# EAGLE schematic ECE411_G16_V12 (EAGLE 9.2.1)
Version 6: Added bypass capacitors to uC +Vcc, added test points for I2C.
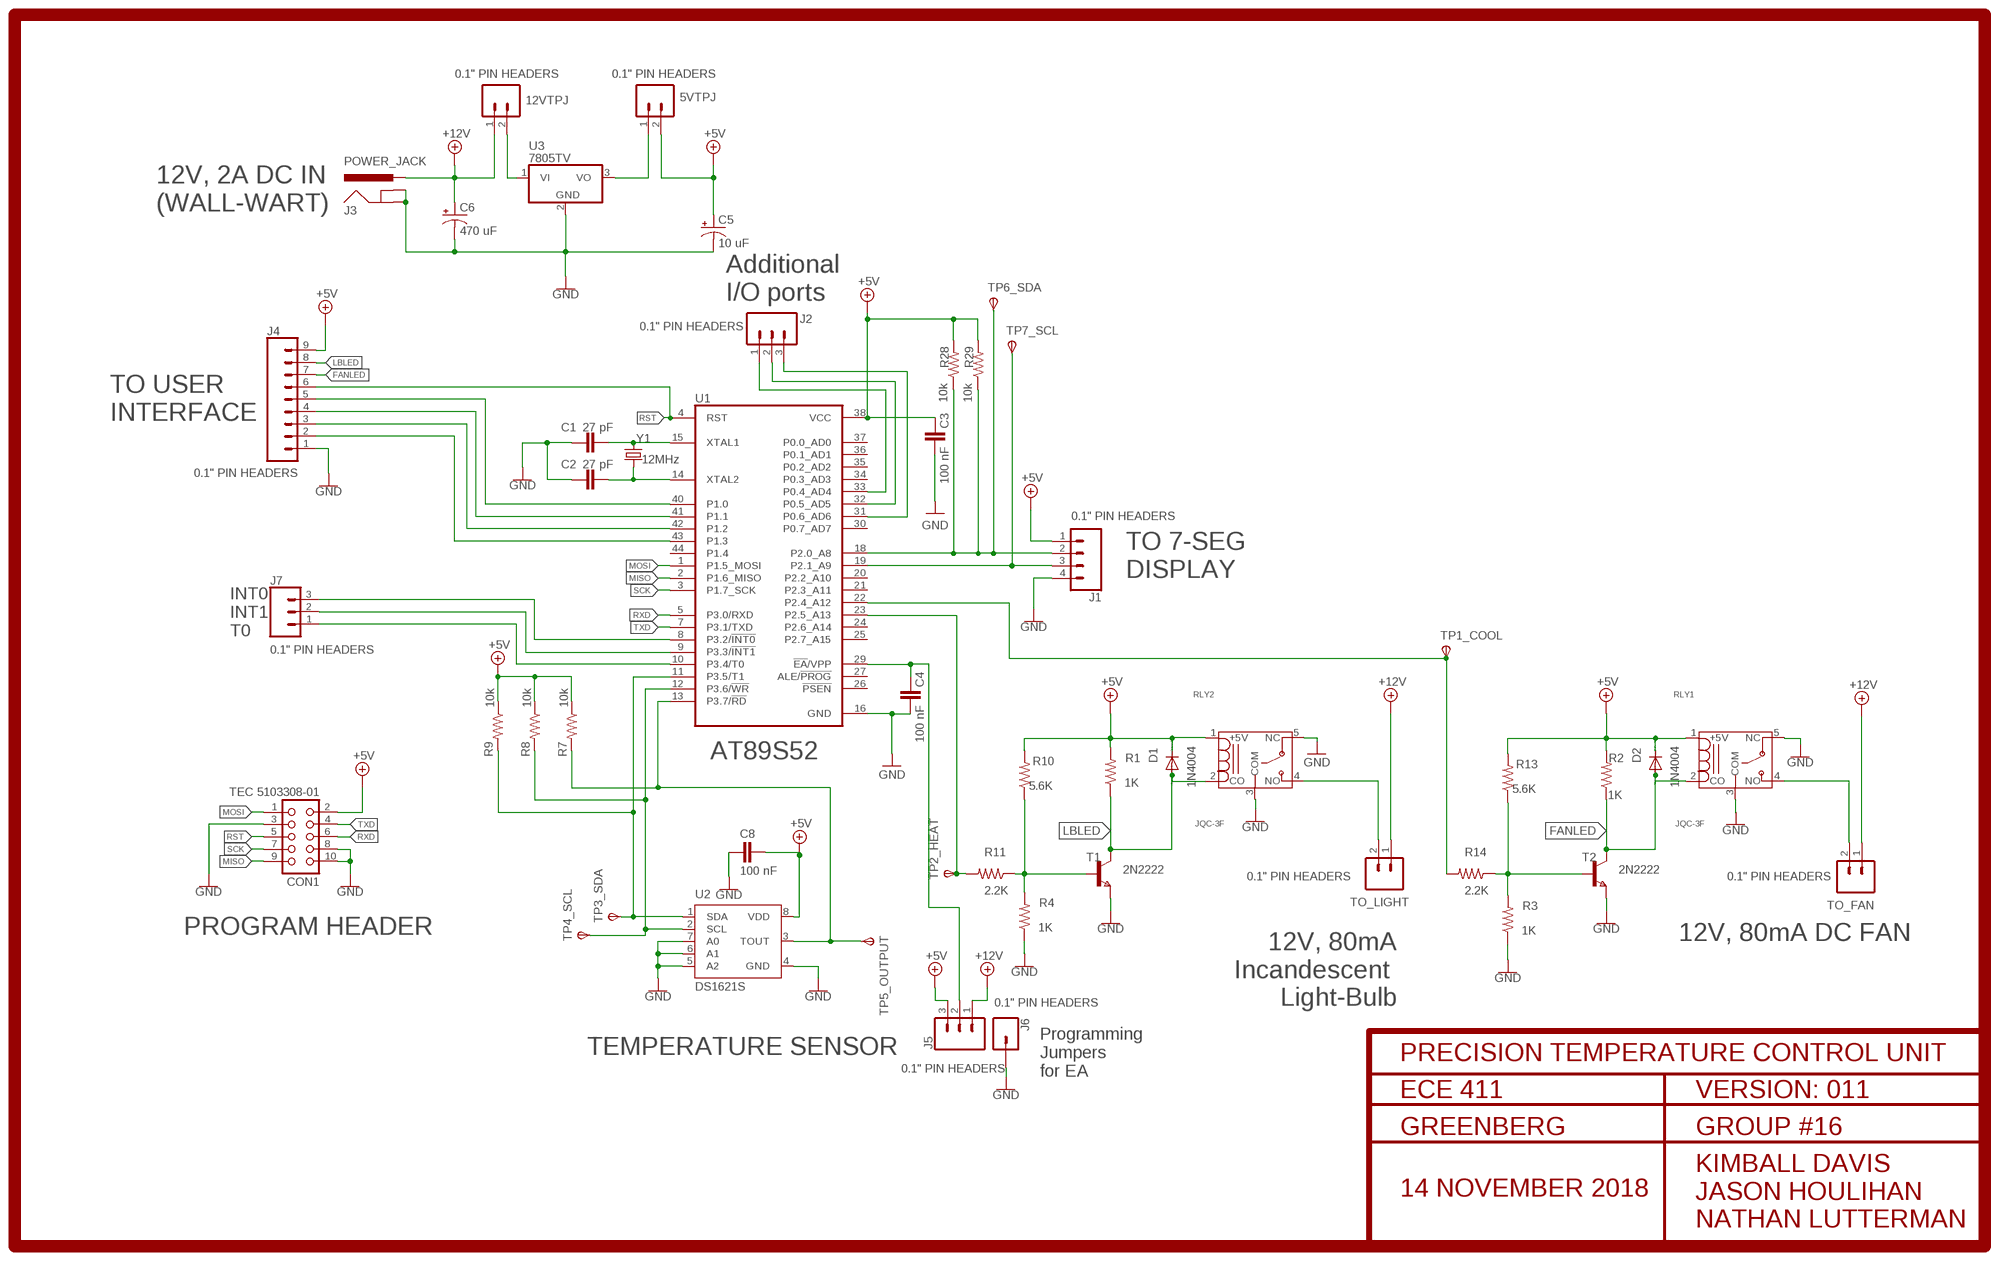
[diagram p0: schematic, sheet 1]

## Parts
5VTPJ  0.1" PIN HEADERS  CONN_02  [1X02]
12VTPJ  0.1" PIN HEADERS  CONN_02  [1X02]
C1  27 pF  CAPACITOR_0603_M  [RESC0603_M]
C2  27 pF  CAPACITOR_0603_M  [RESC0603_M]
C3  100 nF  CAPACITOR_0603_M  [RESC0603_M]
C4  100 nF  CAPACITOR_0603_M  [RESC0603_M]
C5  10 uF  CPOL-USTT2D6  [TT2D6]
C6  470 uF  CPOL-USTT5D11  [TT5D11]
C8  100 nF  CAPACITOR_0603_M  [RESC0603_M]
CON1  TEC 5103308-01  CON10  [CON10]
D1  1N4004  [DO41-10]
D2  1N4004  [DO41-10]
J1  0.1" PIN HEADERS  CONN_04  [1X04]
J2  0.1" PIN HEADERS  CONN_03  [1X03]
J3  POWER_JACK  [POWER_JACK_PTH]
J4  0.1" PIN HEADERS  CONN_09  [1X09]
J5  0.1" PIN HEADERS  CONN_03  [1X03]
J6  0.1" PIN HEADERS  CONN_01  [1X01]
J7  0.1" PIN HEADERS  CONN_03  [1X03]
R1  1K  R-US_R0603  [R0603]
R2  1K  R-US_R0603  [R0603]
R3  1K  R-US_R0603  [R0603]
R4  1K  R-US_R0603  [R0603]
R7  10k  R-US_R0603  [R0603]
R8  10k  R-US_R0603  [R0603]
R9  10k  R-US_R0603  [R0603]
R10  5.6K  R-US_R0603  [R0603]
R11  2.2K  R-US_R0603  [R0603]
R13  5.6K  R-US_R0603  [R0603]
R14  2.2K  R-US_R0603  [R0603]
R28  10k  R-US_R0603  [R0603]
R29  10k  R-US_R0603  [R0603]
RLY1  JQC-3F  [T073]
RLY2  JQC-3F  [T073]
T1  2N2222  NPNSOT23  [SOT-23]
T2  2N2222  NPNSOT23  [SOT-23]
TO_FAN  0.1" PIN HEADERS  CONN_02  [1X02]
TO_LIGHT  0.1" PIN HEADERS  CONN_02  [1X02]
TP1_COOL  TPSTP20SQ  [TP20SQ]
TP2_HEAT  TPSTP20SQ  [TP20SQ]
TP3_SDA  TPSTP20SQ  [TP20SQ]
TP4_SCL  TPSTP20SQ  [TP20SQ]
TP5_OUTPUT  TPSTP20SQ  [TP20SQ]
TP6_SDA  TPSTP20SQ  [TP20SQ]
TP7_SCL  TPSTP20SQ  [TP20SQ]
U1  AT89S52  AT89S51-24P  [TQFP44]
U2  DS1621S  [SO08]
U3  7805TV  [TO220V]
Y1  12MHz  CRYSTAL-12MHZ"  [CRYSTAL-SMD-5X3.2-4PAD]

## Nets
+5V: 5VTPJ.2 C3.2 C5.+ C8.2 CON1.2 D1.C D2.C J1.1 J4.9 J5.3 R1.2 R2.2 R7.1 R8.1 R9.1 R10.2 R13.2 R28.2 R29.2 RLY1.1(+5V) RLY2.1(+5V) U1.38(VCC) U2.8(VDD)
+12V: 12VTPJ.1 C6.+ J3.PWR J5.1 TO_FAN.1 TO_LIGHT.1
FANLED: D2.A J4.7 R2.1 RLY1.2(CO) T2.1(C)
GND: C1.1 C2.1 C3.1 C4.1 C5.- C6.- C8.1 CON1.3 CON1.8 CON1.10 J1.4 J3.GND J3.GNDBREAK J4.1 J6.1 R3.1 R4.1 RLY1.3(COM) RLY1.5(NC) RLY2.3(COM) RLY2.5(NC) T1.2(E) T2.2(E) U1.16(GND) U2.4(GND) U2.5(A2) U2.6(A1) U2.7(A0) U3.2(GND)
LBLED: D1.A J4.8 R1.1 RLY2.2(CO) T1.1(C)
MISO: CON1.9 U1.2(P1.6_MISO)
MOSI: CON1.1 U1.1(P1.5_MOSI)
N$1: C1.2 U1.15(XTAL1) Y1.1
N$2: C2.2 U1.14(XTAL2) Y1.3
N$3: J1.2 R28.1 R29.1 TP6_SDA.TP(PP) U1.18(P2.0_A8)
N$4: J1.3 TP7_SCL.TP(PP) U1.19(P2.1_A9)
N$5: 12VTPJ.2 U3.1(VI)
N$6: 5VTPJ.1 U3.3(VO)
N$7: RLY2.4(NO) TO_LIGHT.2
N$8: C4.2 J5.2 U1.29(!EA!/VPP)
N$9: R7.2 TP5_OUTPUT.TP(PP) U1.13(P3.7/!RD) U2.3(TOUT)
N$10: R8.2 TP4_SCL.TP(PP) U1.12(P3.6/!WR) U2.2(SCL)
N$11: R9.2 TP3_SDA.TP(PP) U1.11(P3.5/T1) U2.1(SDA)
N$12: R11.2 TP2_HEAT.TP(PP) U1.23(P2.5_A13)
N$13: R4.2 R10.1 R11.1 T1.3(B)
N$14: J2.1 U1.33(P0.4_AD4)
N$15: J2.2 U1.32(P0.5_AD5)
N$16: R14.2 TP1_COOL.TP(PP) U1.22(P2.4_A12)
N$17: R3.2 R13.1 R14.1 T2.3(B)
N$18: J2.3 U1.31(P0.6_AD6)
N$20: RLY1.4(NO) TO_FAN.2
N$21: J7.3 U1.8(P3.2/!INT0)
N$22: J7.2 U1.9(P3.3/!INT1)
N$23: J7.1 U1.10(P3.4/T0)
N$34: J4.5 U1.40(P1.0)
N$35: J4.4 U1.41(P1.1)
N$36: J4.3 U1.42(P1.2)
N$37: J4.2 U1.43(P1.3)
RST: CON1.5 J4.6 U1.4(RST)
RXD: CON1.6 U1.5(P3.0/RXD)
SCK: CON1.7 U1.3(P1.7_SCK)
TXD: CON1.4 U1.7(P3.1/TXD)
Unconnected: U1.20(P2.2_A10) U1.21(P2.3_A11) U1.24(P2.6_A14) U1.25(P2.7_A15) U1.26(!PSEN) U1.27(ALE/!PROG) U1.30(P0.7_AD7) U1.34(P0.3_AD3) U1.35(P0.2_AD2) U1.36(P0.1_AD1) U1.37(P0.0_AD0) U1.44(P1.4)

## Notes on the sheet
- 12V, 2A DC IN
  (WALL-WART)
- Additional
  I/O ports
- TO USER
  INTERFACE
- TO 7-SEG 
  DISPLAY
- INT0
  INT1
  T0
- AT89S52
- PROGRAM HEADER | 12V, 80mA DC FAN
- 12V, 80mA
  Incandescent 
  Light-Bulb
- TEMPERATURE SENSOR
- Programming
  Jumpers
  for EA

## Power pins joined to a net without a drawn wire
GND: U1.17(GND)

## Library data of the parts
5VTPJ 12VTPJ TO_FAN TO_LIGHT = SparkFun-Connectors:CONN_02: Multi connection point. Often used as Generic Header-pin footprint for 0.1 inch spaced/style header connections On any of the 0.1 inch spaced packages, you can populate with these: Break Away Headers - Straight <https://www.sparkfun.com/products/116> (PRT-00116) Break Away Male Headers - Right Angle <https://www.sparkfun.com/products/553> (PRT-00553) Female Headers <https://www.sparkfun.com/products/115> (PRT-00115) Break Away Headers - Machine Pin <https://www.sparkfun.com/products/117> (PRT-00117) Break Away Female Headers - Swiss Machine Pin <https://www.sparkfun.com/products/743> (PRT-00743) For SCREWTERMINALS and SPRING TERMINALS visit here: Screw Terimnals on SparkFun.com <https://www.sparkfun.com/search/results?term=Screw+Terminals> (5mm/3.5mm/2.54mm spacing) This device is also useful as a general connection point to wire up your design to another part of your project. Our various solder wires solder well into these plated through hole pads. Hook-Up Wire - Assortment (Stranded, 22 AWG) <https://www.sparkfun.com/products/11375> (PRT-11375) Hook-Up Wire - Assortment (Solid Core, 22 AWG) <https://www.sparkfun.com/products/11367> (PRT-11367) View the entire wire category on our website here <https://www.sparkfun.com/categories/141> Special notes: Molex polarized connector foot print use with: PRT-08233 with associated crimp pins and housings. 2.54_SCREWTERM for use with PRT-10571. 3.5mm Screw Terminal footprints for PRT-08084 5mm Screw Terminal footprints for use with PRT-08432
C1-C4 C8 = Nordic_nRF:CAPACITOR: Generic chip capacitor
C5 C6 = rcl:CPOL-US: POLARIZED CAPACITOR, American symbol; SPICEPREFIX: C
CON1 = con-harting:CON10: CONNECTOR; OC_FARNELL: unknown; OC_NEWARK: unknown
D1 D2 = diode:1N4004: DIODE general purpose rectifier, 1 A
J1 = SparkFun-Connectors:CONN_04: Multi connection point. Often used as Generic Header-pin footprint for 0.1 inch spaced/style header connections On any of the 0.1 inch spaced packages, you can populate with these: Break Away Headers - Straight <https://www.sparkfun.com/products/116> (PRT-00116) Break Away Male Headers - Right Angle <https://www.sparkfun.com/products/553> (PRT-00553) Female Headers <https://www.sparkfun.com/products/115> (PRT-00115) Break Away Headers - Machine Pin <https://www.sparkfun.com/products/117> (PRT-00117) Break Away Female Headers - Swiss Machine Pin <https://www.sparkfun.com/products/743> (PRT-00743) For SCREWTERMINALS and SPRING TERMINALS visit here: Screw Terimnals on SparkFun.com <https://www.sparkfun.com/search/results?term=Screw+Terminals> (5mm/3.5mm/2.54mm spacing) This device is also useful as a general connection point to wire up your design to another part of your project. Our various solder wires solder well into these plated through hole pads. Hook-Up Wire - Assortment (Stranded, 22 AWG) <https://www.sparkfun.com/products/11375> (PRT-11375) Hook-Up Wire - Assortment (Solid Core, 22 AWG) <https://www.sparkfun.com/products/11367> (PRT-11367) View the entire wire category on our website here <https://www.sparkfun.com/categories/141> Special notes: Molex polarized connector foot print use with SKU : PRT-08231 with associated crimp pins and housings. 1MM SMD Version SKU: PRT-10208; PROD_ID: CONN-09696
J2 J5 J7 = SparkFun-Connectors:CONN_03: Multi connection point. Often used as Generic Header-pin footprint for 0.1 inch spaced/style header connections On any of the 0.1 inch spaced packages, you can populate with these: Break Away Headers - Straight <https://www.sparkfun.com/products/116> (PRT-00116) Break Away Male Headers - Right Angle <https://www.sparkfun.com/products/553> (PRT-00553) Female Headers <https://www.sparkfun.com/products/115> (PRT-00115) Break Away Headers - Machine Pin <https://www.sparkfun.com/products/117> (PRT-00117) Break Away Female Headers - Swiss Machine Pin <https://www.sparkfun.com/products/743> (PRT-00743) Stackable Header - 3 Pin (Female, 0.1") <https://www.sparkfun.com/products/13875> (PRT-13875) For SCREWTERMINALS and SPRING TERMINALS visit here: Screw Terimnals on SparkFun.com <https://www.sparkfun.com/search/results?term=Screw+Terminals> (5mm/3.5mm/2.54mm spacing) This device is also useful as a general connection point to wire up your design to another part of your project. Our various solder wires solder well into these plated through hole pads. Hook-Up Wire - Assortment (Stranded, 22 AWG) <https://www.sparkfun.com/products/11375> (PRT-11375) Hook-Up Wire - Assortment (Solid Core, 22 AWG) <https://www.sparkfun.com/products/11367> (PRT-11367) View the entire wire category on our website here <https://www.sparkfun.com/categories/141> Special notes: Molex polarized connector foot print use with SKU : PRT-08232 with associated crimp pins and housings.
J3 = SparkFun-Connectors:POWER_JACK: Power Jack Connector This is the standard 5.5mm barrel jack for power. The PTH is the most common, proven, reliable, footprint. The Slot footprint only works if the mill layer is transmitted to the PCB fab house so be warned. Here are the connectors we sell at SparkFun: DC Barrel Power Jack/Connector <https://www.sparkfun.com/products/119> (PRT-00119) DC Barrel Power Jack/Connector (SMD) <https://www.sparkfun.com/products/12748> (PRT-12748) DC Barrel Jack Adapter - Breadboard Compatible <https://www.sparkfun.com/products/10811> (PRT-10811) It is used on this SparkFun product (and many, many others): SparkFun RedBoard - Programmed with Arduino <https://www.sparkfun.com/products/12757> (DEV-12757) Also, if you need a mating power supply or connector, please check these out: Wall Adapter Power Supply - 9VDC 650mA <https://www.sparkfun.com/products/298> (TOL-00298) DC Barrel Jack Adapter - Male <https://www.sparkfun.com/products/10287> (PRT-10287); PROD_ID: CONN-08197
J4 = SparkFun-Connectors:CONN_09: Multi connection point. Often used as Generic Header-pin footprint for 0.1 inch spaced/style header connections On any of the 0.1 inch spaced packages, you can populate with these: Break Away Headers - Straight <https://www.sparkfun.com/products/116> (PRT-00116) Break Away Male Headers - Right Angle <https://www.sparkfun.com/products/553> (PRT-00553) Female Headers <https://www.sparkfun.com/products/115> (PRT-00115) Break Away Headers - Machine Pin <https://www.sparkfun.com/products/117> (PRT-00117) Break Away Female Headers - Swiss Machine Pin <https://www.sparkfun.com/products/743> (PRT-00743) For SCREWTERMINALS and SPRING TERMINALS visit here: Screw Terimnals on SparkFun.com <https://www.sparkfun.com/search/results?term=Screw+Terminals> (5mm/3.5mm/2.54mm spacing) This device is also useful as a general connection point to wire up your design to another part of your project. Our various solder wires solder well into these plated through hole pads. Hook-Up Wire - Assortment (Stranded, 22 AWG) <https://www.sparkfun.com/products/11375> (PRT-11375) Hook-Up Wire - Assortment (Solid Core, 22 AWG) <https://www.sparkfun.com/products/11367> (PRT-11367) View the entire wire category on our website here <https://www.sparkfun.com/categories/141> Special notes: Molex polarized connector foot print use with SKU : PRT-08231 with associated crimp pins and housings. 1MM SMD Version SKU: PRT-10208 NOTES ON THE VARIANTS LOCK and LOCK_LONGPADS... This footprint was designed to help hold the alignment of a through-hole component (i.e. 6-pin header) while soldering it into place. You may notice that each hole has been shifted either up or down by 0.005 of an inch from it's more standard position (which is a perfectly straight line). This slight alteration caused the pins (the squares in the middle) to touch the edges of the holes. Because they are alternating, it causes a "brace" to hold the component in place. 0.005 has proven to be the perfect amount of "off-center" position when using our standard breakaway headers. Although looks a little odd when you look at the bare footprint, once you have a header in there, the alteration is very hard to notice. Also,if you push a header all the way into place, it is covered up entirely on the bottom side.
J6 = SparkFun-Connectors:CONN_01: Single connection point. Often used as Generic Header-pin footprint for 0.1 inch spaced/style header connections On any of the 0.1 inch spaced packages, you can populate with these: Break Away Headers - Straight <https://www.sparkfun.com/products/116> (PRT-00116) Break Away Male Headers - Right Angle <https://www.sparkfun.com/products/553> (PRT-00553) Female Headers <https://www.sparkfun.com/products/115> (PRT-00115) Break Away Headers - Machine Pin <https://www.sparkfun.com/products/117> (PRT-00117) Break Away Female Headers - Swiss Machine Pin <https://www.sparkfun.com/products/743> (PRT-00743) This device is also useful as a general connection point to wire up your design to another part of your project. Our various solder wires solder well into these plated through hole pads. Hook-Up Wire - Assortment (Stranded, 22 AWG) <https://www.sparkfun.com/products/11375> (PRT-11375) Hook-Up Wire - Assortment (Solid Core, 22 AWG) <https://www.sparkfun.com/products/11367> (PRT-11367) View the entire wire category on our website here <https://www.sparkfun.com/categories/141> Special notes: SMTSO-256-ET is a "flush mount" nut for a 4-40 screw. We mostly use this on specialty testbeds; it is a nice way to connect hardware to your PCB at an adjustable hieght. Also note, the SNAP packages are for using a snappable style connector. We sell a baggie of snaps and they are also used on two LilyPad designs: Snap Assortment - 30 pack (male and female) <https://www.sparkfun.com/products/11347> (DEV-11347) LilyPad Arduino SimpleSnap <https://www.sparkfun.com/products/10941> (DEV-10941) LilyPad SimpleSnap Protoboard <https://www.sparkfun.com/products/10940> (DEV-10940)
R1-R4 R7-R11 R13 R14 R28 R29 = audio amplifier example:R-US_: RESISTOR, American symbol
RLY1 RLY2 = JQC-3F:JQC-3F
T1 T2 = zetex:NPNSOT23: NPN TRANSISTOR; MPN: DSS20201L-7; OC_FARNELL: 1710688; OC_NEWARK: 25R4555
TP1_COOL TP2_HEAT TP3_SDA TP4_SCL TP5_OUTPUT TP6_SDA TP7_SCL = testpad:TPS: TEST PIN
U1 = atmel:AT89S51*P: 8-bit Microcontroller with 4K BytesIn-System Programmable Flash Source: http://www.atmel.com/dyn/resources/prod_documents/doc2487.pdf; OC_FARNELL: unknown; OC_NEWARK: unknown
U2 = maxim:DS1621: Digital Thermometer and Thermostat Source: http://pdfserv.maxim-ic.com/en/ds/DS1621.pdf; MF: DALLAS SEMICONDUCTOR; MPN: DS1621S+; OC_FARNELL: 9725261; OC_NEWARK: 23K3501
U3 = linear:78*: Positive VOLTAGE REGULATOR Source: http://cache.national.com/ds/LM/LM78L05.pdf http://www.fairchildsemi.com/ds/LM/LM7805.pdf
Y1 = SparkFun-Clocks:CRYSTAL-12MHZ: 12.0MHz Crystal Frequency: 12.0MHz Frequency Tolerance: ±20ppm Load Capacitance: 18pF SparkFun Products: SparkFun Logomatic <https://www.sparkfun.com/products/12772> Pocket AVR Programmer <https://www.sparkfun.com/products/9825>; PROD_ID: XTAL-08297